# Altium schematic sheet ZHSD-PL-CONNS.SchDoc
size A4; DrawnBy: UGUR KELES; DocumentNumber: 17; SheetNumber: 17; SheetTotal: 17; Size: A4
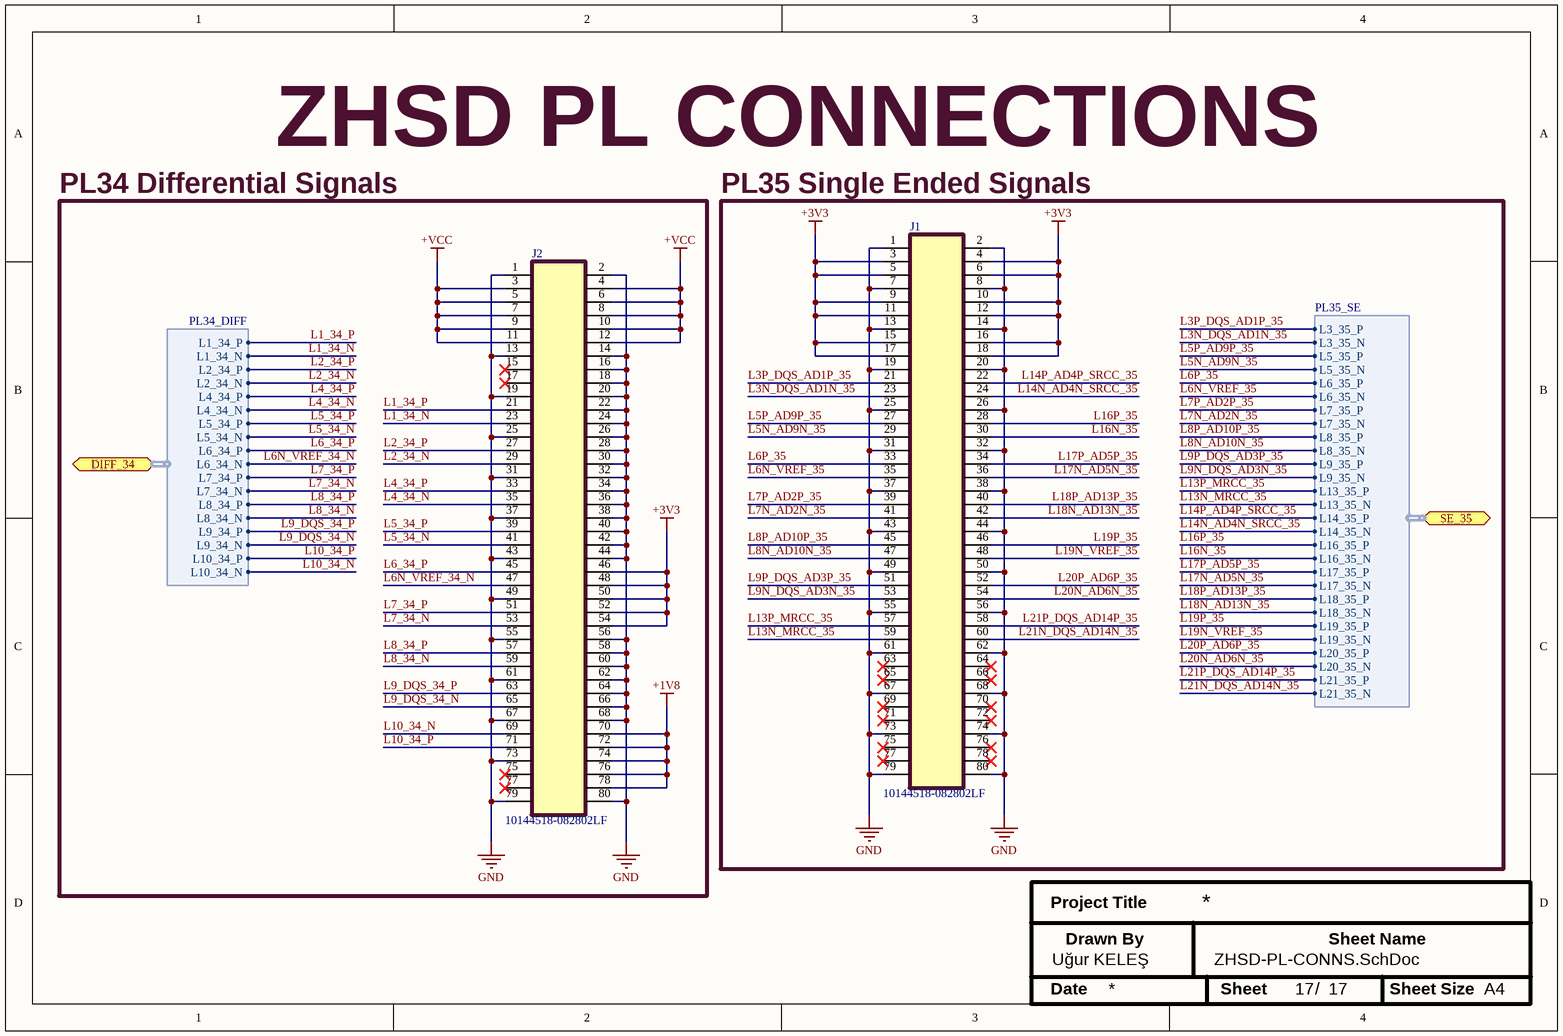
[diagram p0: ZHSD-PL-CONNS.SchDoc]

## Parts
J1  10144518-082802LF  [10144518-082802LF]
J2  10144518-082802LF  [10144518-082802LF]

## Blocks framed on the sheet
PL34 Differential Signals: J2
PL35 Single Ended Signals: J1

## Ports
DIFF_34 (bidir, harness PL34_DIFF, see ZHSD-Block[8400,1700], ZHSD-ZYNQ-PL[8700,7800]), SE_35 (bidir, harness PL35_SE, see ZHSD-Block[8400,1400], ZHSD-ZYNQ-PL[14400,2800])

## Harnesses
PL34_DIFF: L1_34_P, L1_34_N, L2_34_P, L2_34_N, L4_34_P, L4_34_N, L5_34_P, L5_34_N, L6_34_P, L6_34_N, L7_34_P, L7_34_N, L8_34_P, L8_34_N, L9_34_P, L9_34_N, L10_34_P, L10_34_N
PL35_SE: L3_35_P, L3_35_N, L5_35_P, L5_35_N, L6_35_P, L6_35_N, L7_35_P, L7_35_N, L8_35_P, L8_35_N, L9_35_P, L9_35_N, L13_35_P, L13_35_N, L14_35_P, L14_35_N, L16_35_P, L16_35_N, L17_35_P, L17_35_N, L18_35_P, L18_35_N, L19_35_P, L19_35_N, L20_35_P, L20_35_N, L21_35_P, L21_35_N

## Nets
+1V8: J2.70 J2.72 J2.74 J2.76 J2.78
+3V3: J1.3 J1.4 J1.5 J1.6 J1.9 J1.10 J1.11 J1.12 J1.15 J1.16 J1.17 J1.18 J2.46 J2.48 J2.50 J2.52 J2.54
+VCC: J2.3 J2.4 J2.5 J2.6 J2.7 J2.8 J2.9 J2.10 J2.11 J2.12
GND: J1.1 J1.2 J1.7 J1.8 J1.13 J1.14 J1.19 J1.20 J1.25 J1.26 J1.31 J1.32 J1.37 J1.38 J1.43 J1.44 J1.49 J1.50 J1.55 J1.56 J1.61 J1.62 J1.67 J1.68 J1.73 J1.74 J1.79 J1.80 J2.1 J2.2 J2.13 J2.14 J2.16 J2.18 J2.19 J2.20 J2.22 J2.24 J2.25 J2.26 J2.28 J2.30 J2.31 J2.32 J2.34 J2.36 J2.37 J2.38 J2.40 J2.42 J2.43 J2.44 J2.49 J2.55 J2.56 J2.58 J2.60 J2.61 J2.62 J2.64 J2.66 J2.67 J2.68 J2.73 J2.79 J2.80
L1_34_N: J2.23 ; port DIFF_34.L1_34_N
L1_34_P: J2.21 ; port DIFF_34.L1_34_P
L2_34_N: J2.29 ; port DIFF_34.L2_34_N
L2_34_P: J2.27 ; port DIFF_34.L2_34_P
L3N_DQS_AD1N_35: J1.23 ; port SE_35.L3_35_N
L3P_DQS_AD1P_35: J1.21 ; port SE_35.L3_35_P
L4_34_N: J2.35 ; port DIFF_34.L4_34_N
L4_34_P: J2.33 ; port DIFF_34.L4_34_P
L5_34_N: J2.41 ; port DIFF_34.L5_34_N
L5_34_P: J2.39 ; port DIFF_34.L5_34_P
L5N_AD9N_35: J1.29 ; port SE_35.L5_35_N
L5P_AD9P_35: J1.27 ; port SE_35.L5_35_P
L6_34_P: J2.45 ; port DIFF_34.L6_34_P
L6N_VREF_34_N: J2.47 ; port DIFF_34.L6_34_N
L6N_VREF_35: J1.35 ; port SE_35.L6_35_N
L6P_35: J1.33 ; port SE_35.L6_35_P
L7_34_N: J2.53 ; port DIFF_34.L7_34_N
L7_34_P: J2.51 ; port DIFF_34.L7_34_P
L7N_AD2N_35: J1.41 ; port SE_35.L7_35_N
L7P_AD2P_35: J1.39 ; port SE_35.L7_35_P
L8_34_N: J2.59 ; port DIFF_34.L8_34_N
L8_34_P: J2.57 ; port DIFF_34.L8_34_P
L8N_AD10N_35: J1.47 ; port SE_35.L8_35_N
L8P_AD10P_35: J1.45 ; port SE_35.L8_35_P
L9_DQS_34_N: J2.65 ; port DIFF_34.L9_34_N
L9_DQS_34_P: J2.63 ; port DIFF_34.L9_34_P
L9N_DQS_AD3N_35: J1.53 ; port SE_35.L9_35_N
L9P_DQS_AD3P_35: J1.51 ; port SE_35.L9_35_P
L10_34_N: J2.69 ; port DIFF_34.L10_34_N
L10_34_P: J2.71 ; port DIFF_34.L10_34_P
L13N_MRCC_35: J1.59 ; port SE_35.L13_35_N
L13P_MRCC_35: J1.57 ; port SE_35.L13_35_P
L14N_AD4N_SRCC_35: J1.24 ; port SE_35.L14_35_N
L14P_AD4P_SRCC_35: J1.22 ; port SE_35.L14_35_P
L16N_35: J1.30 ; port SE_35.L16_35_N
L16P_35: J1.28 ; port SE_35.L16_35_P
L17N_AD5N_35: J1.36 ; port SE_35.L17_35_N
L17P_AD5P_35: J1.34 ; port SE_35.L17_35_P
L18N_AD13N_35: J1.42 ; port SE_35.L18_35_N
L18P_AD13P_35: J1.40 ; port SE_35.L18_35_P
L19N_VREF_35: J1.48 ; port SE_35.L19_35_N
L19P_35: J1.46 ; port SE_35.L19_35_P
L20N_AD6N_35: J1.54 ; port SE_35.L20_35_N
L20P_AD6P_35: J1.52 ; port SE_35.L20_35_P
L21N_DQS_AD14N_35: J1.60 ; port SE_35.L21_35_N
L21P_DQS_AD14P_35: J1.58 ; port SE_35.L21_35_P

Not connected (* = marked no-connect by the designer): J1 63* 64* 65* 66* 69* 70* 71* 72* 75* 76* 77* 78*; J2 15* 17* 75* 77*

## Notes on the sheet
- ZHSD PL CONNECTIONS
- Project Title
- Uğur KELEŞ
- Drawn By
- Sheet Name
- Date
- Sheet
- /
- Sheet Size
- A4

## Library data of the parts
J1 J2 = 10144518-082802LF: BergStak® Lite 0.80mm, Board-to-Board Connector, 80 Positions, Dual Row, Vertical Header; Manufacturer: Amphenol; MPN: 10144518-082802LF